# EasyEDA schematic Sheet_2.json
TITLE: Sheet_1; REV: 1.0; Date: 2021-09-27; Sheet: 1/1; Drawn By: Михаил Серов; Company: Your Company
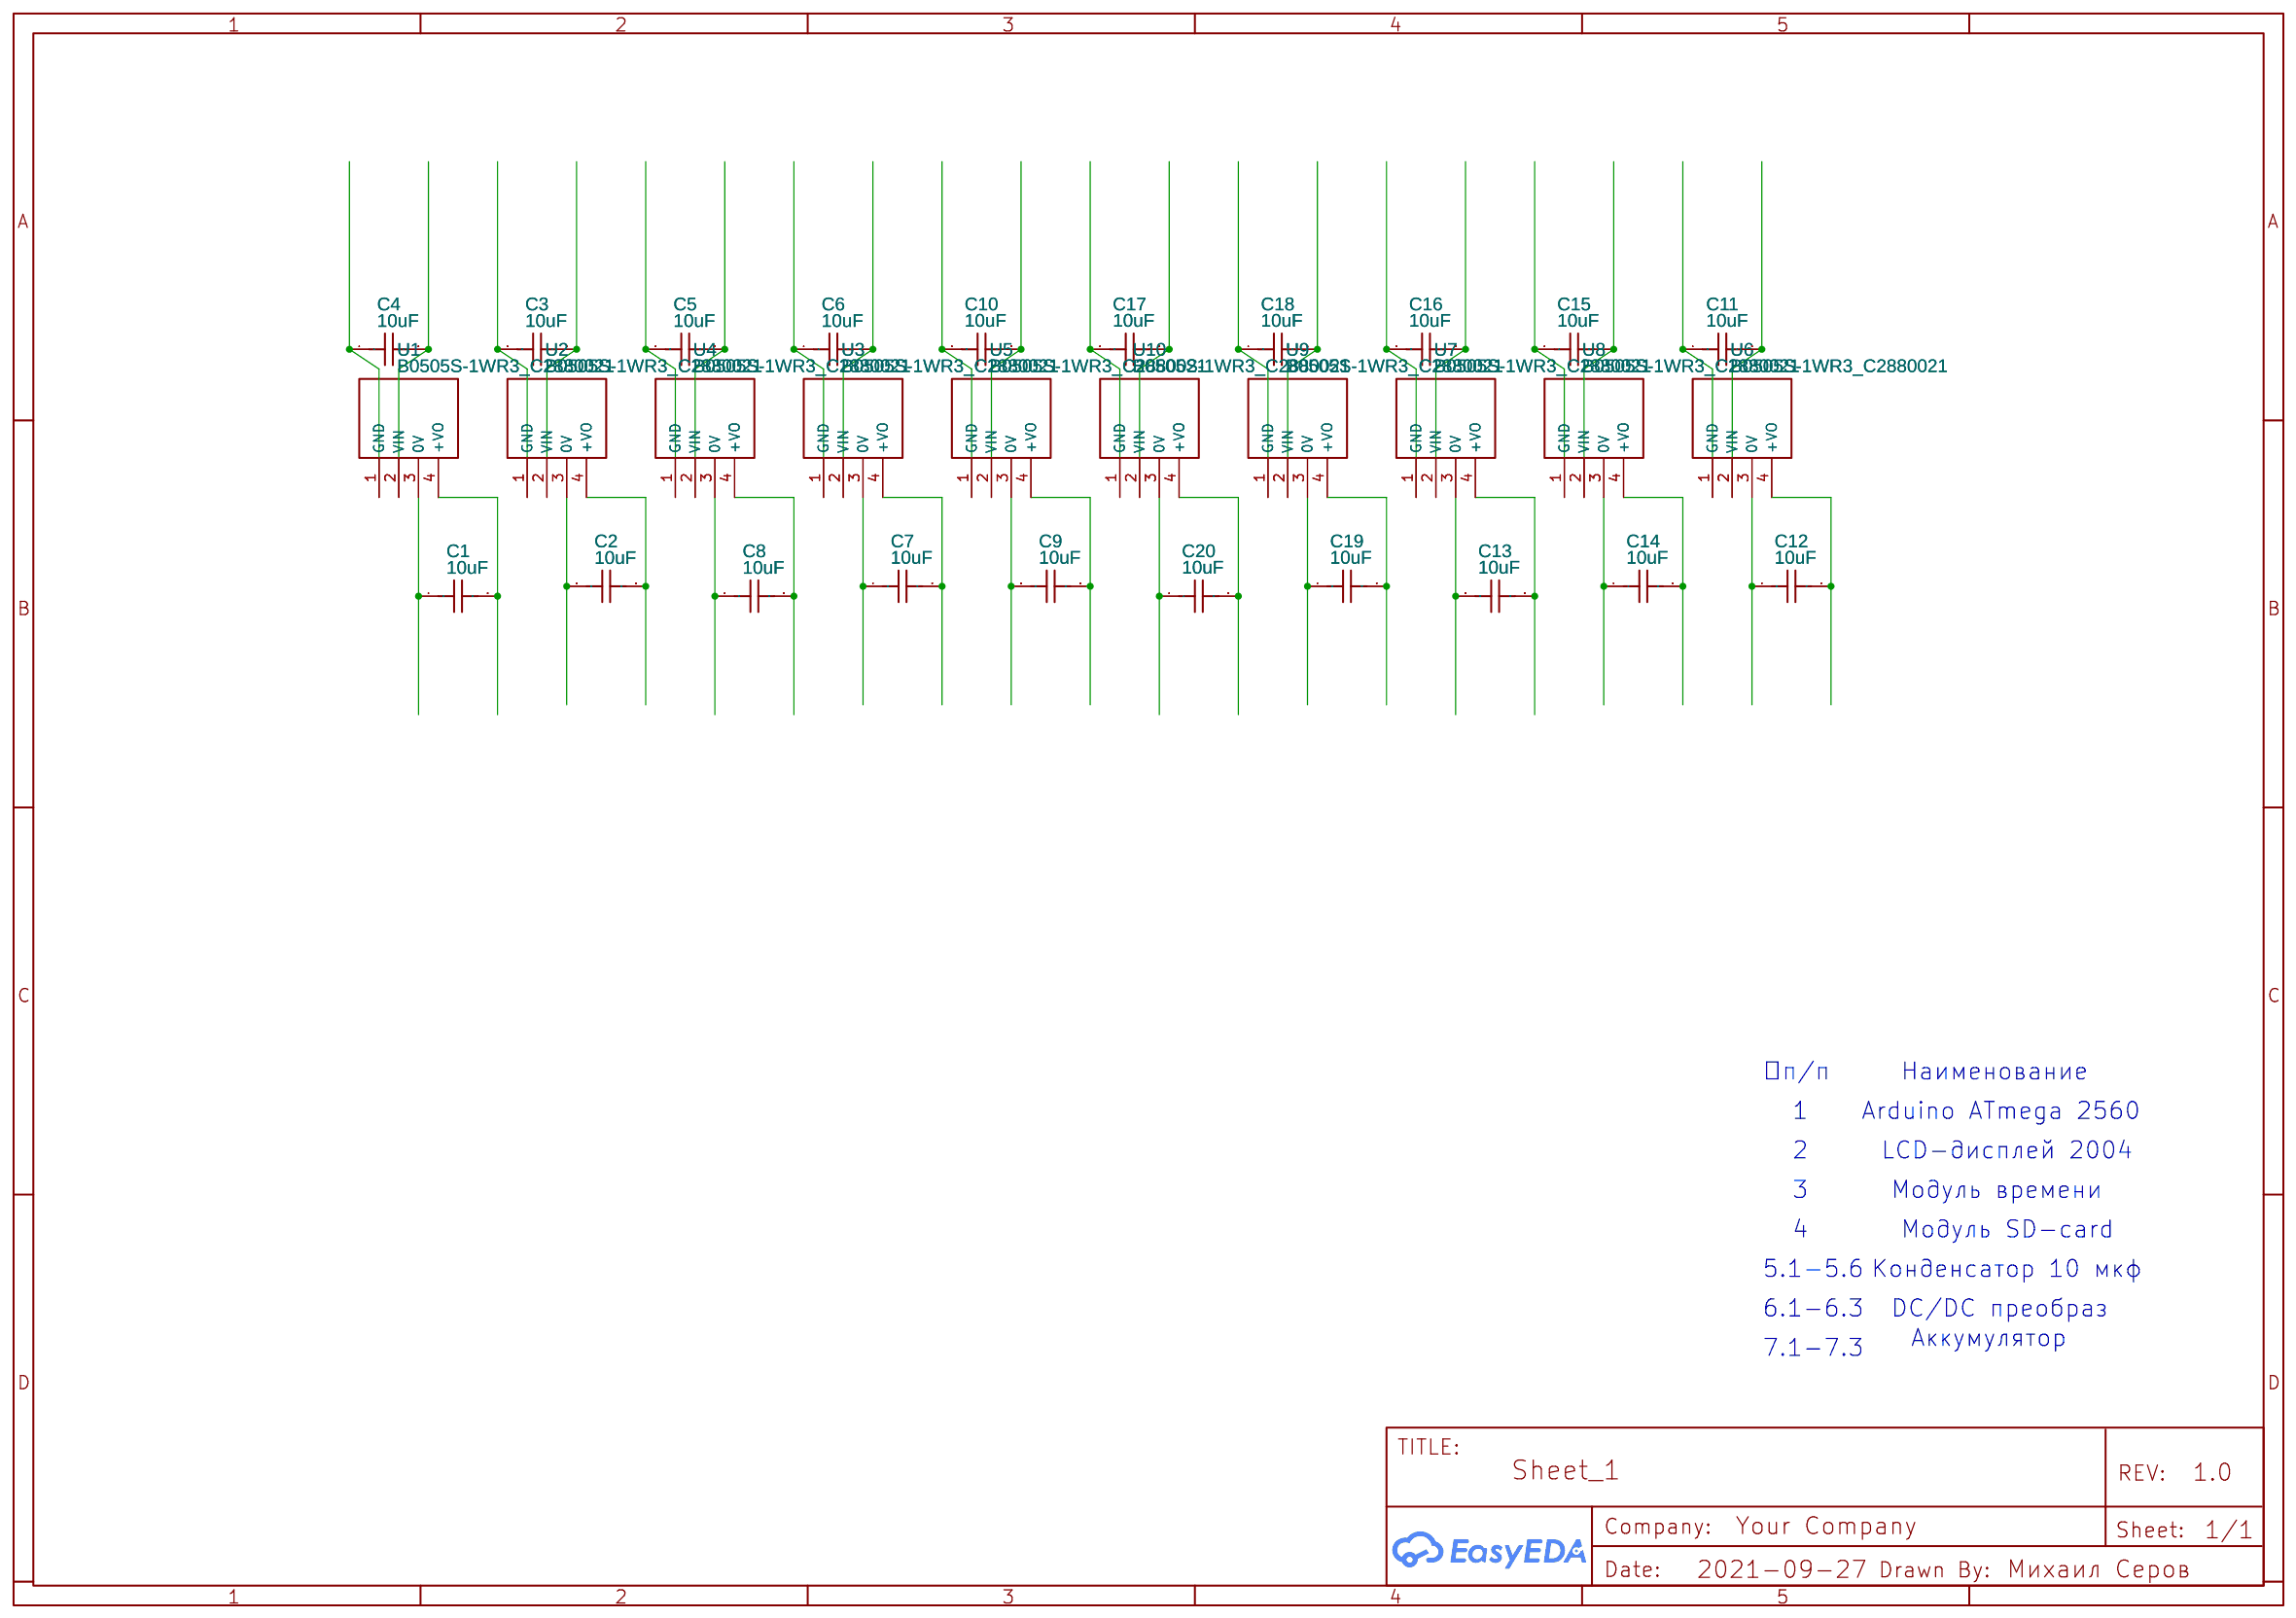
[diagram p0: schematic sheet]

## Parts
C1  10uF  [C1206]
C2  10uF  [C1206]
C3  10uF  [C1206]
C4  10uF  [C1206]
C5  10uF  [C1206]
C6  10uF  [C1206]
C7  10uF  [C1206]
C8  10uF  [C1206]
C9  10uF  [C1206]
C10  10uF  [C1206]
C11  10uF  [C1206]
C12  10uF  [C1206]
C13  10uF  [C1206]
C14  10uF  [C1206]
C15  10uF  [C1206]
C16  10uF  [C1206]
C17  10uF  [C1206]
C18  10uF  [C1206]
C19  10uF  [C1206]
C20  10uF  [C1206]
U1  B0505S-1WR3_C2880021  [PWRM-TH_B0505S-1WR3]
U2  B0505S-1WR3_C2880021  [PWRM-TH_B0505S-1WR3]
U3  B0505S-1WR3_C2880021  [PWRM-TH_B0505S-1WR3]
U4  B0505S-1WR3_C2880021  [PWRM-TH_B0505S-1WR3]
U5  B0505S-1WR3_C2880021  [PWRM-TH_B0505S-1WR3]
U6  B0505S-1WR3_C2880021  [PWRM-TH_B0505S-1WR3]
U7  B0505S-1WR3_C2880021  [PWRM-TH_B0505S-1WR3]
U8  B0505S-1WR3_C2880021  [PWRM-TH_B0505S-1WR3]
U9  B0505S-1WR3_C2880021  [PWRM-TH_B0505S-1WR3]
U10  B0505S-1WR3_C2880021  [PWRM-TH_B0505S-1WR3]

## Library data of the parts
C1-C20 = CS3216X7R106K250NRI: Supplier: LCSC; Supplier Part: C513767; Manufacturer: Samwha Capacitor; Contributor: LCSC
U1-U10 = B0505S-1WR3_C2880021: Supplier: LCSC; Supplier Part: C2880021; Manufacturer: 清远特斯拉(TESL*A); Manufacturer Part: B0505S-1WR3; Contributor: LCSC

## Nets
Net-(C1-1): C1.1 U1.3(0V)
Net-(C1-2): C1.2 U1.4(+VO)
Net-(C2-1): C2.1 U2.3(0V)
Net-(C2-2): C2.2 U2.4(+VO)
Net-(C3-1): C3.1 U2.1(GND)
Net-(C3-2): C3.2 U2.2(VIN)
Net-(C4-1): C4.1 U1.1(GND)
Net-(C4-2): C4.2 U1.2(VIN)
Net-(C5-1): C5.1 U4.1(GND)
Net-(C5-2): C5.2 U4.2(VIN)
Net-(C6-1): C6.1 U3.1(GND)
Net-(C6-2): C6.2 U3.2(VIN)
Net-(C7-1): C7.1 U3.3(0V)
Net-(C7-2): C7.2 U3.4(+VO)
Net-(C8-1): C8.1 U4.3(0V)
Net-(C8-2): C8.2 U4.4(+VO)
Net-(C9-1): C9.1 U5.3(0V)
Net-(C9-2): C9.2 U5.4(+VO)
Net-(C10-1): C10.1 U5.1(GND)
Net-(C10-2): C10.2 U5.2(VIN)
Net-(C11-1): C11.1 U6.1(GND)
Net-(C11-2): C11.2 U6.2(VIN)
Net-(C12-1): C12.1 U6.3(0V)
Net-(C12-2): C12.2 U6.4(+VO)
Net-(C13-1): C13.1 U7.3(0V)
Net-(C13-2): C13.2 U7.4(+VO)
Net-(C14-1): C14.1 U8.3(0V)
Net-(C14-2): C14.2 U8.4(+VO)
Net-(C15-1): C15.1 U8.1(GND)
Net-(C15-2): C15.2 U8.2(VIN)
Net-(C16-1): C16.1 U7.1(GND)
Net-(C16-2): C16.2 U7.2(VIN)
Net-(C17-1): C17.1 U10.1(GND)
Net-(C17-2): C17.2 U10.2(VIN)
Net-(C18-1): C18.1 U9.1(GND)
Net-(C18-2): C18.2 U9.2(VIN)
Net-(C19-1): C19.1 U9.3(0V)
Net-(C19-2): C19.2 U9.4(+VO)
Net-(C20-1): C20.1 U10.3(0V)
Net-(C20-2): C20.2 U10.4(+VO)

## Notes on the sheet
- №п/п
- Наименование
- 1
- Arduino ATmega 2560
- 2
- LCD-дисплей 2004
- 3
- Модуль времени
- 4
- Модуль SD-card
- 5.1-5.6
- Конденсатор 10 мкф
- 6.1-6.3
- DC/DC преобраз
- Аккумулятор
- 7.1-7.3
